# EAGLE design RFµ Chip antenna example (EAGLE 6.1)
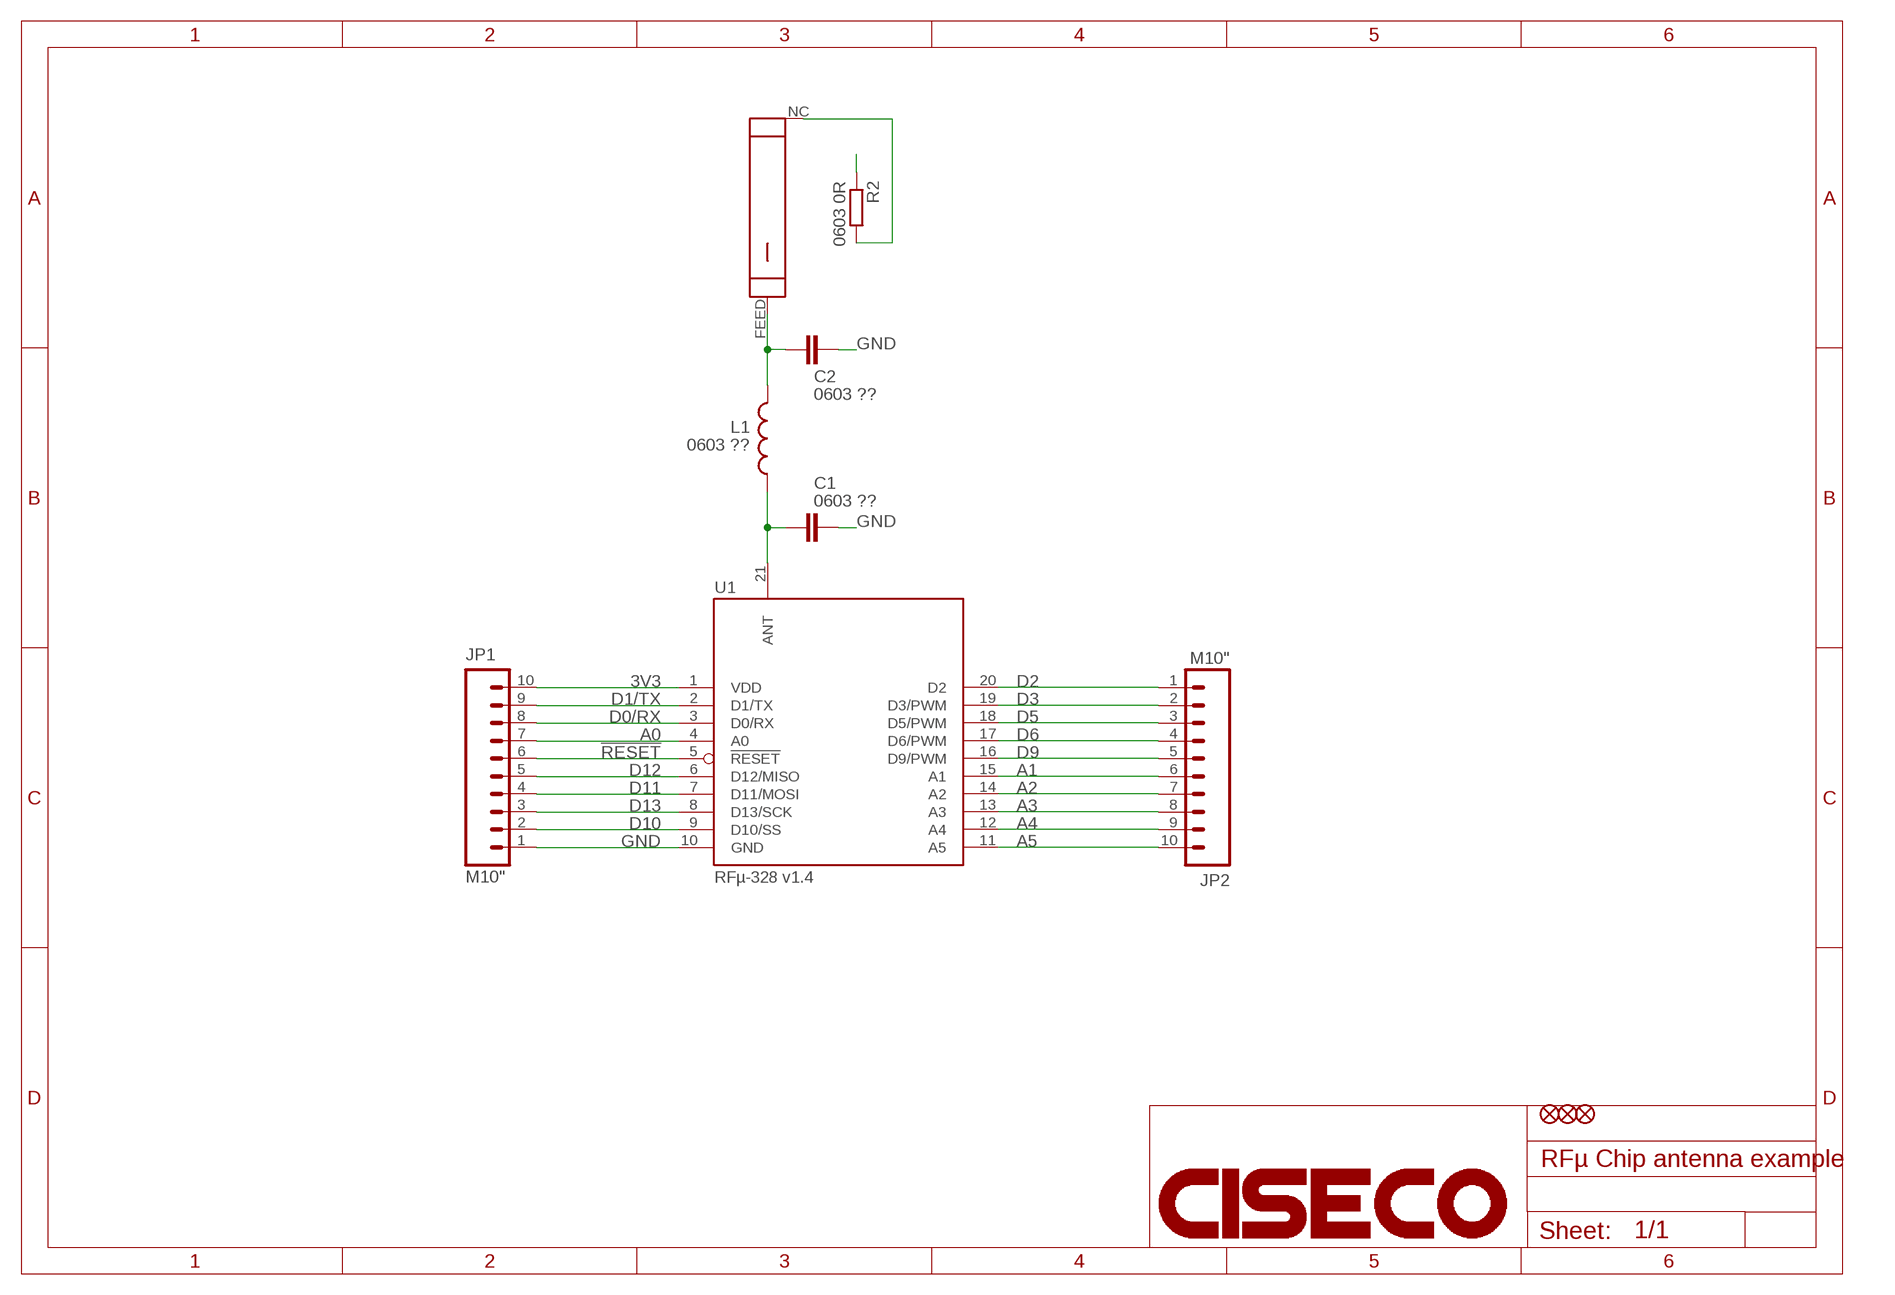
[diagram p0: schematic, sheet 1]

## Parts
C1  0603 ??  C-EUC0603K-SMALL  [C0603K-SMALL]
C2  0603 ??  C-EUC0603K-SMALL  [C0603K-SMALL]
JP1  M10"  [1X10]
JP2  M10"  [1X10]
JP3  FIDUCIAL1X2.5-STOP  [FIDUCIAL-1X2.5-STOP]
JP4  FIDUCIAL1X2.5-STOP  [FIDUCIAL-1X2.5-STOP]
JP5  FIDUCIAL1X2.5-STOP  [FIDUCIAL-1X2.5-STOP]
L1  0603 ??  INDUCTOR0603K-SMALL  [C0603K-SMALL]
LOGO1  CISECOLOGO-4MM  [CISECO-4MM]
R2  0603 0R  R-EU_0603K-SMALL  [C0603K-SMALL]
U1  RFµ-328 v1.4  RFµ-328-SMD-V2.0  [RFµ-LANDING-V2.0]
U$1  JTICHIPANT  [JTICHIPANT]

## Nets
3V3: JP1.10 U1.1(VDD)
!RESET: JP1.6 U1.5(!RESET)
A0: JP1.7 U1.4(A0)
A1: JP2.6 U1.15(A1)
A2: JP2.7 U1.14(A2)
A3: JP2.8 U1.13(A3)
A4: JP2.9 U1.12(A4)
A5: JP2.10 U1.11(A5)
ANT [ANT]: C1.1 L1.1 U1.21(ANT)
D0/RX: JP1.8 U1.3(D0/RX)
D1/TX: JP1.9 U1.2(D1/TX)
D2: JP2.1 U1.20(D2)
D3: JP2.2 U1.19(D3/PWM)
D5: JP2.3 U1.18(D5/PWM)
D6: JP2.4 U1.17(D6/PWM)
D9: JP2.5 U1.16(D9/PWM)
D10: JP1.2 U1.9(D10/SS)
D11: JP1.4 U1.7(D11/MOSI)
D12: JP1.5 U1.6(D12/MISO)
D13: JP1.3 U1.8(D13/SCK)
GND: C1.2 C2.2 JP1.1 U1.10(GND)
N$22 [ANT]: C2.1 L1.2 U$1.FEED
N$25: R2.2 U$1.NC
N$26: R2.1

## Library data of the parts
C1 C2 = CISECO eaglecad designs:C-EU: CAPACITOR, European symbol
JP1 JP2 = CISECO eaglecad designs:M10: Header 10 Standard 10-pin 0.1" header. Use with straight break away headers (SKU : PRT-00116), right angle break away headers (PRT-00553), swiss pins (PRT-00743), machine pins (PRT-00117), and female headers (PRT-00115).
JP3-JP5 = CISECO eaglecad designs:FIDUCIAL: Fiducial Alignment Points Various fiducial points for machine vision alignment.
L1 = CISECO eaglecad designs:INDUCTOR: Inductors Basic Inductor/Choke - 0603 and 1206. Footprints are not proven and vary greatly between part numbers.
LOGO1 = Ciseco Footprints:CISECOLOGO
R2 = CISECO eaglecad designs:R-EU_: RESISTOR, European symbol
U1 = Ciseco Footprints:RFµ-328-SMD
U$1 = Ciseco Footprints:JTICHIPANT

## Net classes
1 ANT: width 1.27 mm, clearance 0.45 mm

## Board
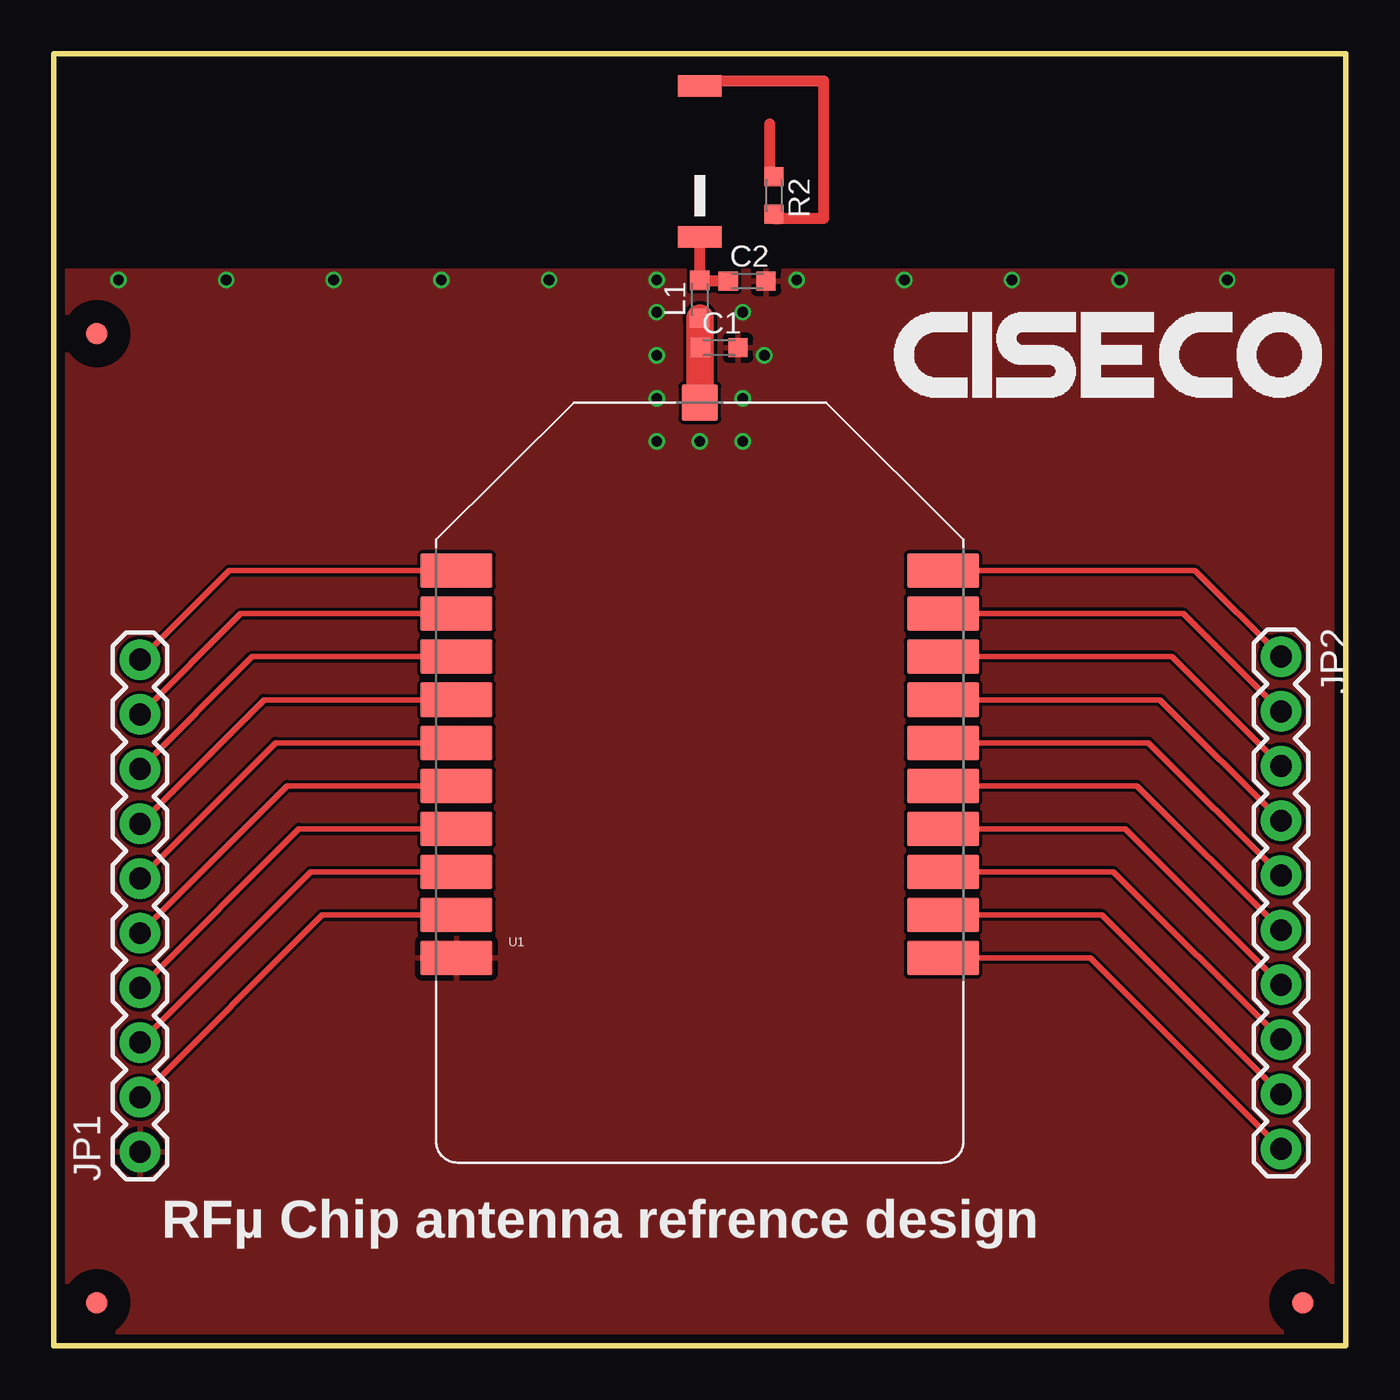
[diagram p1: board, top side]
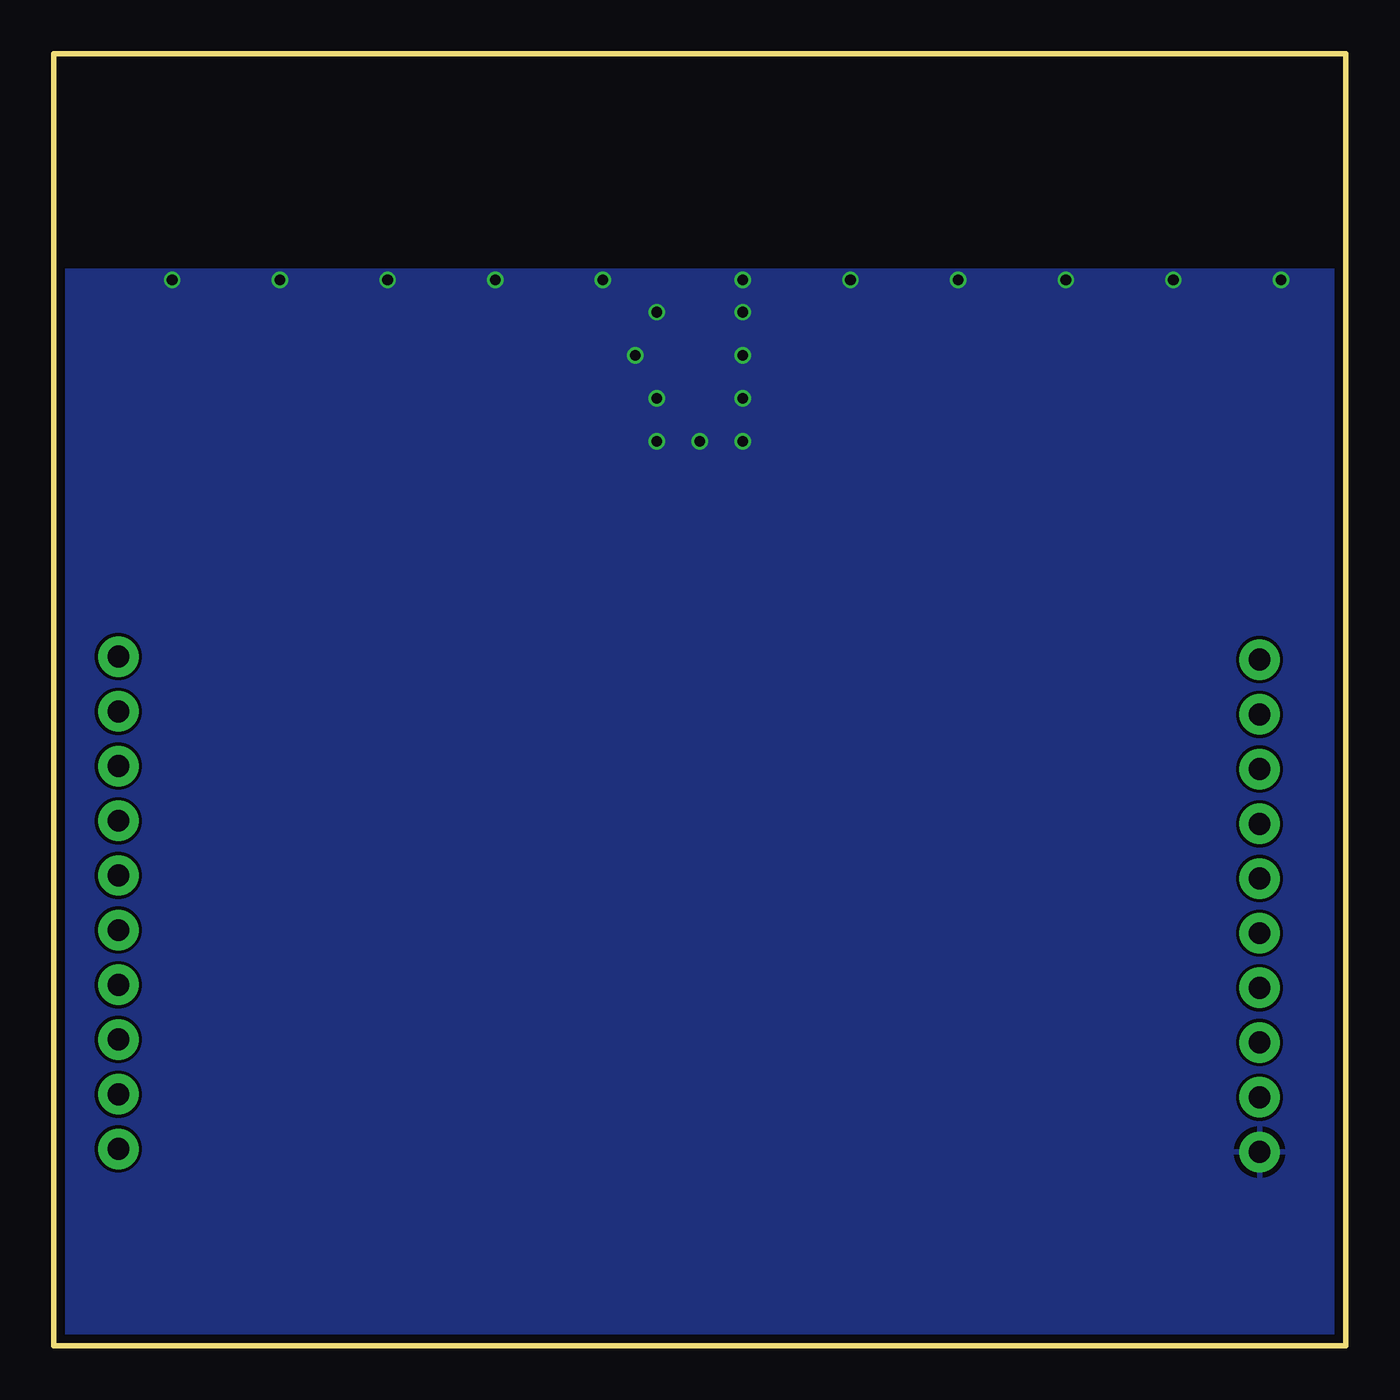
[diagram p2: board, bottom side, seen from below]

Size 60 x 60 mm. Coordinates in mm from the lower left corner, seen from the top.
Outline: 0,0 60,0 60,60 0,60 0,0
Copper layers (1*16): Top 0.035mm / dielectric 1mm / Bottom 0.035mm
Design rules: minimum track width 0.15mm, minimum drill 0.3mm, track to track 0.15mm, track to pad 0.15mm, pad to pad 0.15mm, via to via 0.15mm, smd to smd 0.15mm, copper to edge 0.4mm, drill to drill 0.15mm, minimum pad ring 10mil, minimum via ring 5mil, stop-mask expansion 4mil, vias tented up to drill 0.6mm, thermal gap 10mil

### Footprints (pad centres in the part's own frame; a part is rotated, then mirrored left to right if it is on the bottom)
C0603K-SMALL = smd 0.889 x 0.889: 1 -0.875,0; 2 0.875,0
1X10 = drill 1.016 pad 1.88: 1 0,0; 2 2.54,0; 3 5.08,0; 4 7.62,0; 5 10.16,0; 6 12.7,0; 7 15.24,0; 8 17.78,0; 9 20.32,0; 10 22.86,0
FIDUCIAL-1X2.5-STOP = smd 1 x 1: 1 0,0
RFµ-LANDING-V2.0 = smd 3.35 x 1.6: 1 -11.3,20; 2 -11.3,18; 3 -11.3,16; 4 -11.3,14; 5 -11.3,12; 6 -11.3,10; 7 -11.3,8; 8 -11.3,6; 9 -11.3,4; 10 -11.3,2; 11 11.3,2; 12 11.3,4; 13 11.3,6; 14 11.3,8; 15 11.3,10; 16 11.3,12; 17 11.3,14; 18 11.3,16; 19 11.3,18; 20 11.3,20 | smd 1.7 x 1.7: 21 0,27.8
JTICHIPANT = smd 1 x 2: FEED -3.51,0; NC 3.51,0

### Placement (x,y rotation side)
C1  30.9,46.35 0 top
C2  32.2,49.45 0 top
JP1  4,9 90 top
JP2  57,32 270 top
JP3  2,2 0 top
JP4  58,2 0 top
JP5  2,47 0 top
L1  30,48.6 90 top
LOGO1  39,44 0 top
R2  33.45,53.42 270 top
U1  30,16 0 top
U$1  30,55 90 top

### Tracks (layer width: path | path; a pad name or v marks a point on that pad's centre or on a via)
3V3
  Top 0.254: JP1.10 8.14,36 U1.1
!RESET
  Top 0.254: JP1.6 10.3,28 U1.5
A0
  Top 0.254: JP1.7 9.76,30 U1.4
A1
  Top 0.254: JP2.6 50.3,26 U1.15
A2
  Top 0.254: JP2.7 49.76,24 U1.14
A3
  Top 0.254: JP2.8 49.22,22 U1.13
A4
  Top 0.254: JP2.9 48.68,20 U1.12
A5
  Top 0.254: JP2.10 48.14,18 U1.11
ANT
  Top 0.5: 30,47.65 30.02,47.65 C1.1
  Top 1.27: L1.1 30,47.65 U1.21
D0/RX
  Top 0.254: JP1.8 9.22,32 U1.3
D1/TX
  Top 0.254: JP1.9 8.68,34 U1.2
D2
  Top 0.254: JP2.1 53,36 U1.20
D3
  Top 0.254: JP2.2 52.46,34 U1.19
D5
  Top 0.254: JP2.3 51.92,32 U1.18
D6
  Top 0.254: JP2.4 51.38,30 U1.17
D9
  Top 0.254: JP2.5 50.84,28 U1.16
D10
  Top 0.254: JP1.2 12.46,20 U1.9
D11
  Top 0.254: JP1.4 11.38,24 U1.7
D12
  Top 0.254: JP1.5 10.84,26 U1.6
D13
  Top 0.254: JP1.3 11.92,22 U1.8
GND  (via drill 0.5)
  other vias: 28,48 28,49.5 28,46 28,44 33,46 32,48 34.5,49.5 32,44 32,42 30,42 28,42 23,49.5 18,49.5 13,49.5 8,49.5 3,49.5 39.5,49.5 44.5,49.5 49.5,49.5 54.5,49.5
  pour Bottom: 0,0 60,0 60,49.9 0,49.9
  pour Top: 0,0 60,0 60,49.9 0,49.9
N$22
  Top 0.5: L1.2 30,49.5 | 30,49.5 U$1.FEED | C2.1 29.97,49.45 29.97,49.53 30,49.5
N$25
  Top 0.5: U$1.NC 30,58.75 35.75,58.75 35.75,52.35 33.75,52.35 33.45,52.35 | R2.2 33.45,52.35 | 33.45,52.35 33.4,52.35
N$26
  Top 0.5: R2.1 33.25,54.3 33.25,56.75

### Text on the board
tPlace: RFµ Chip antenna refrence design